# EasyEDA Pro project 4090_Portable_Fan.epro, schematic Schematic1_1
Board Name: 单节电池主板; Create Date: 2025-02-24; Page Name: P1; Project Name: 基于STC8G的风扇控制主板; Schematic Name: Schematic1; Update Date: 2025-12-03; BladeWidth: 10; Company: 嘉立创EDA; Page Size: A4; RegionStart: 1; ShowBorder: 1; TitleBlock: 1; TitleBlockPosition: 3; Version: V1.0; XRegionCount: 6; YRegionCount: 4
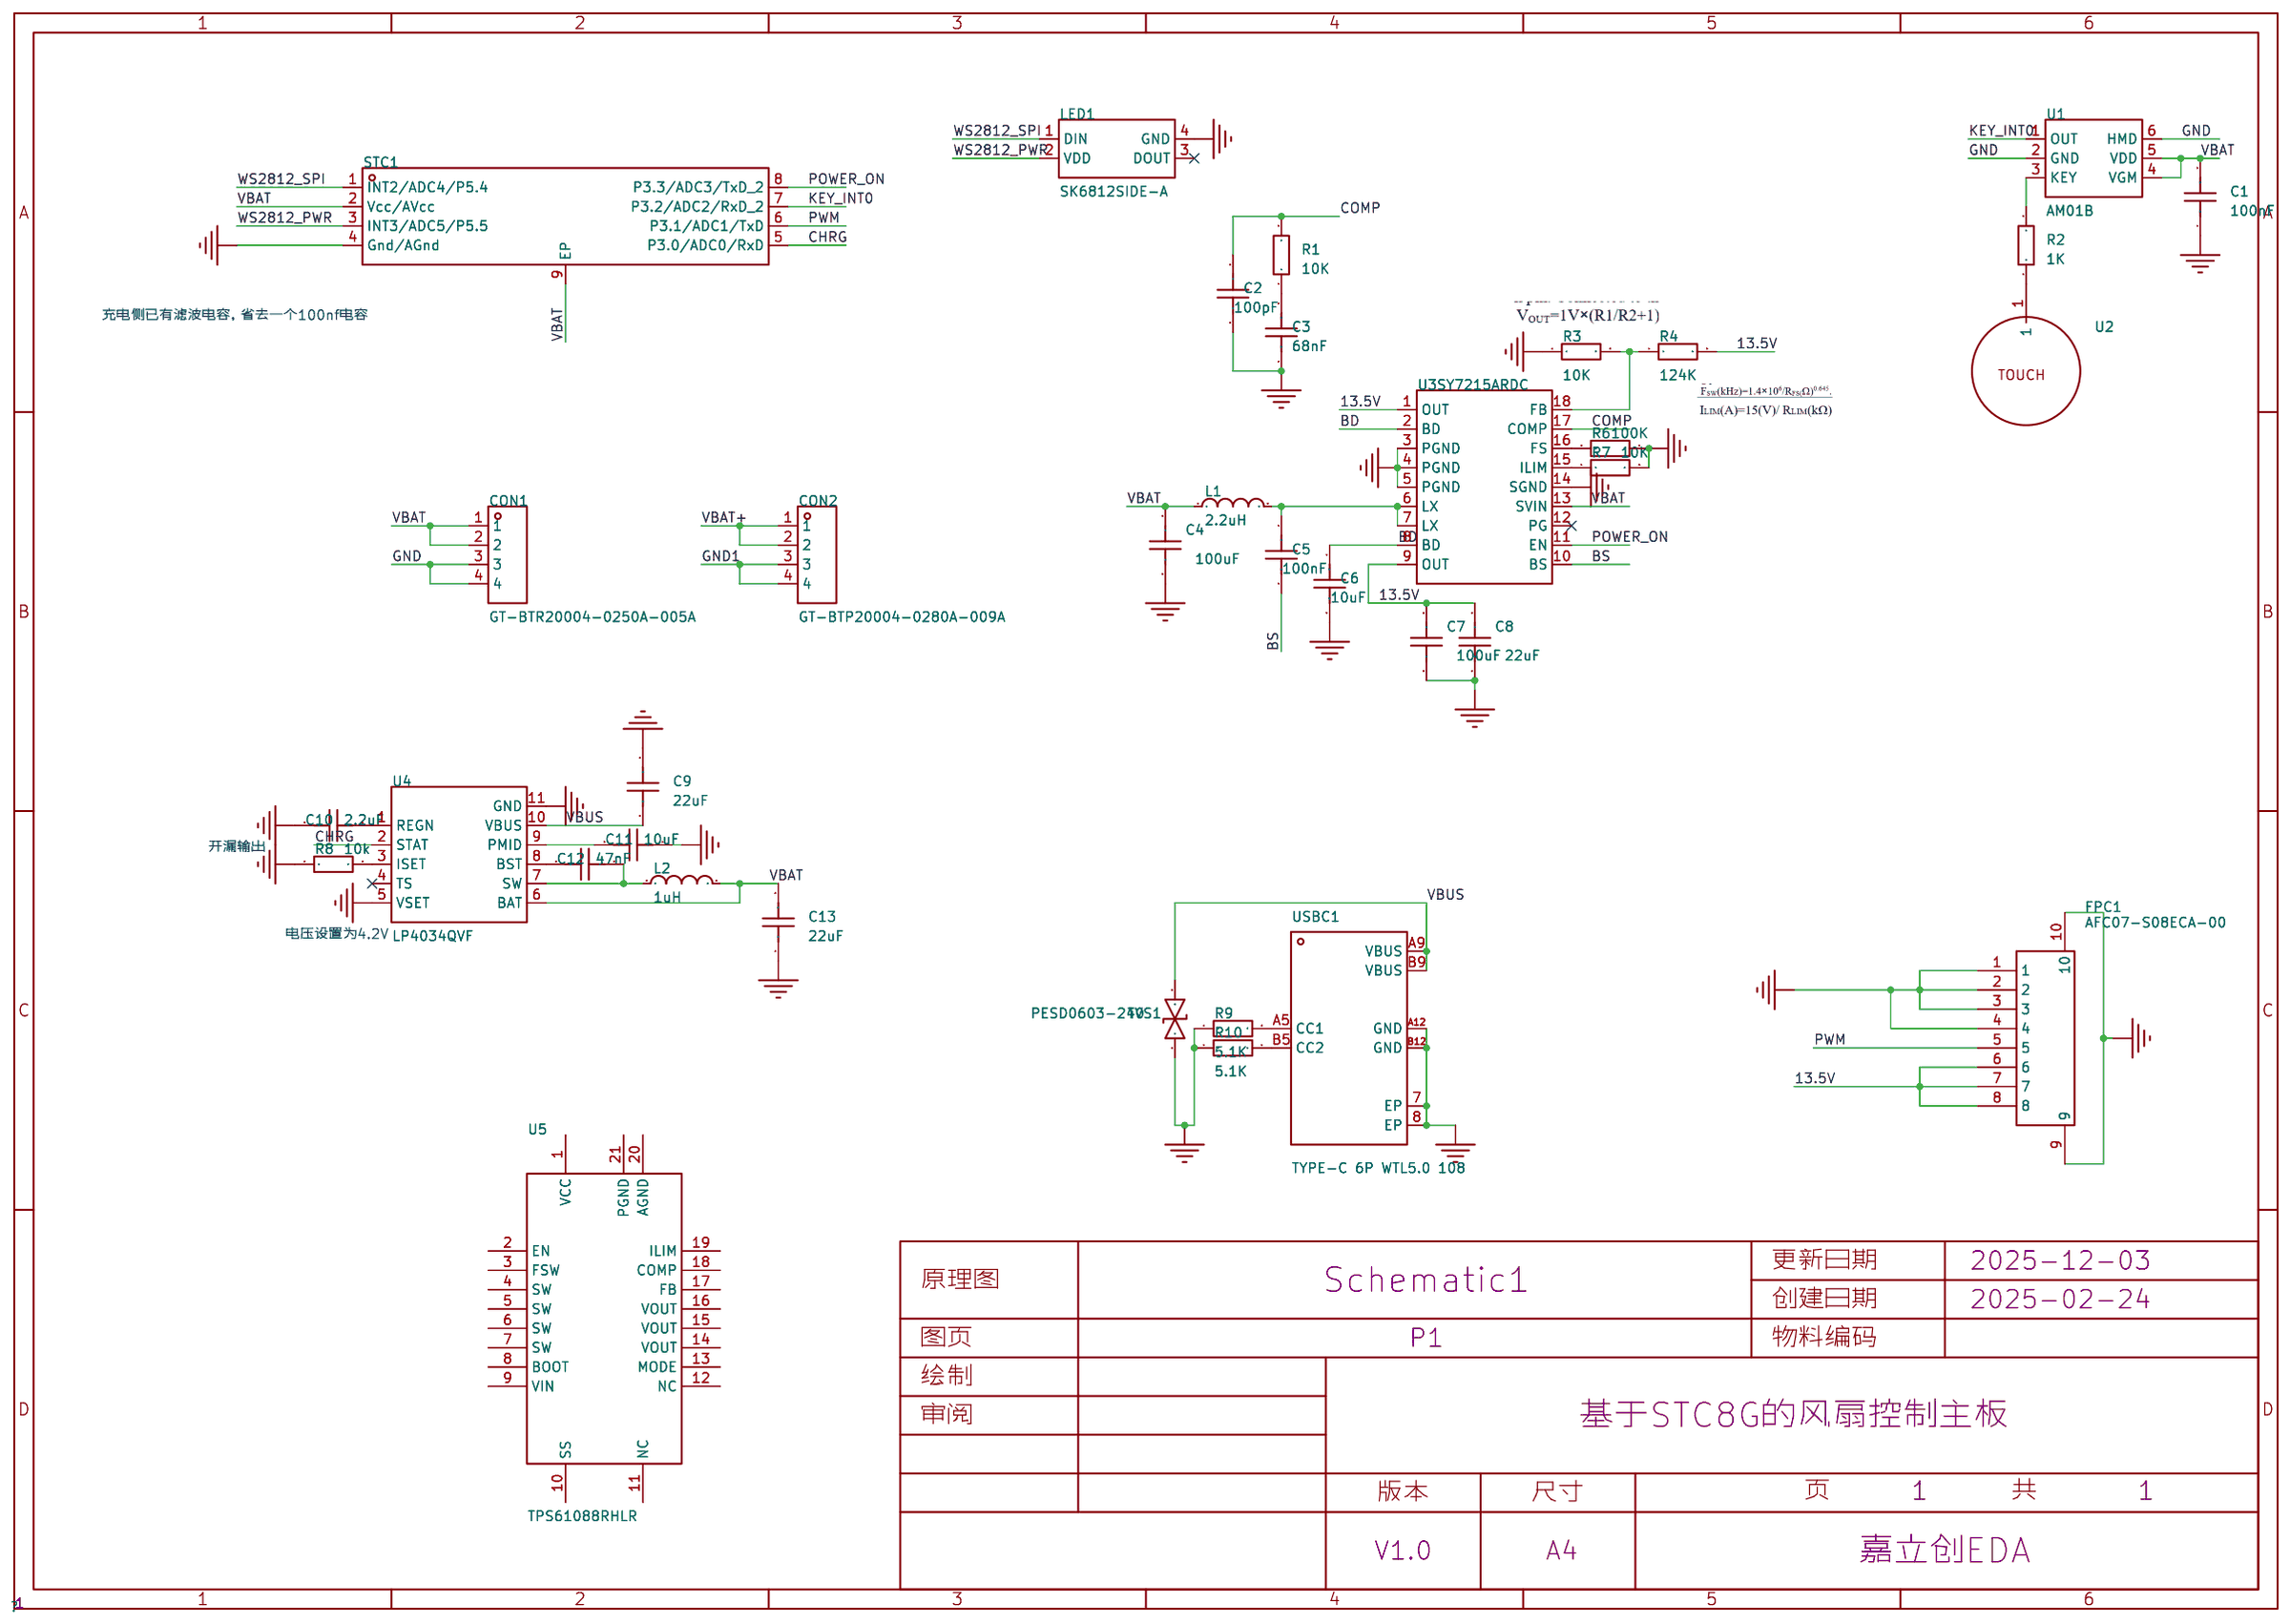
[diagram p2: schematic sheet]

## Parts
C1  100nF  [0805_S]
C2  100pF  [0805_S]
C3  68nF  [0805_S]
C4  100uF  [C1210]
C5  100nF  [0805_S]
C6  10uF  [0805_S]
C7  100uF  [C1210]
C8  22uF  [0805_S]
C9  22uF  [0805_S]
C10  2.2uF  [0805_S]
C11  10uF  [0805_S]
C12  47nF  [0805_S]
C13  22uF  [0805_S]
CON1  GT-BTR20004-0250A-005A  [CONN-SMD_GT-BTR20004-0250A-005A]
CON2  GT-BTP20004-0280A-009A  [CONN-TH_GT-BTP20004-0280A-009A]
FPC1  AFC07-S08ECA-00  [FPC-SMD_P0.5-8P_LCS-SH-H2.0]
L1  2.2uH  [IND-SMD_L7.0-W6.6_MCW-0650-220]
L2  1uH  [IND-SMD_L5.4-W5.2_FXL0530]
LED1  SK6812SIDE-A  [LED-SMD_4P-L4.0-W1.6-L]
R1  10K  [0805_S]
R2  1K  [0805_S]
R3  10K  [0805_S]
R4  124K  [0805_S]
R6  100K  [0805_S]
R7  10K  [0805_S]
R8  10k  [0805_S]
R9  5.1K  [0805_S]
R10  5.1K  [0805_S]
STC1  STC8G1K08A-36I-DFN8  [DFN-8_L3.0-W3.0-P0.50-BL-EP]
TVS1  PESD0603-240  [D0603-BI]
U1  AM01B  [SOT-23-6_L2.9-W1.6-P0.95-LS2.8-BL]
U2  -  [F9-10-6-0.4喇叭口无针触摸弹簧]
U3  SY7215ARDC  [QFN-18_L4.0-W4.0_SY7215ARDC]
U4  LP4034QVF  [DFN-10_L3.0-W3.0-P0.50-BL-EP2.5]
U5  TPS61088RHLR  [VQFN-20_L4.6-W3.6-P0.50-BL]
USBC1  TYPE-C 6P WTL5.0 108  [USB-C-SMD_TYPE-C-6P-WTL5.0-108]

## Library data of the parts
C1-C3 C5 C6 = CAP_604: Supplier Footprint: 0603
C4 C7 = HGC1210R5107M160NSVK: 容值:100uF;精度:±20%;额定电压:16V;温度系数:X5R;; LCSC Part Name: 100uF ±20% 16V; Supplier Part: C7432790; Manufacturer: Chinocera(华瓷); Supplier Footprint: 1210; JLCPCB Part Class: Extended Part; Datasheet: https://item.szlcsc.com/datasheet/HGC1210R5107M160NSVK/8438272.html; Supplier: LCSC; Tolerance: ±20%; Voltage Rating: 16V; Temperature Coefficient: X5R
C8-C13 = CAP_0603: Supplier Footprint: 0603
CON1 = GT-BTR20004-0250A-005A: 刀片电池母座/插接2.0间距/4PIN/塑高2.5/SMT有柱/4A; LCSC Part Name: 卧式Pitch2.0 4P电池母座; Supplier Part: C29780049; Manufacturer: G-Switch(品赞); Supplier Footprint: 插件,P=2mm; JLCPCB Part Class: 扩展库; Datasheet: https://atta.szlcsc.com/upload/public/pdf/source/20240802/6397B66360824D8B1E2E84EB4C77B31A.pdf; Supplier: LCSC; Connect Type: 刀片接触型(母); Pitch: 2mm; Number of Pins: 4P; Mounting Style: 立贴; Current Rating (Max): 4A; Voltage Rating (Max): 20V; Operating Temperature Range: -40℃~+85℃
CON2 = GT-BTP20004-0280A-009A: 刀片电池公座/插接2.0间距/4PIN/塑高2.8/SMT有柱/4A; LCSC Part Name: 立式Pitch2.0 4P电池公座; Supplier Part: C29780051; Manufacturer: G-Switch(品赞); Supplier Footprint: 插件,P=2mm; JLCPCB Part Class: 扩展库; Datasheet: https://atta.szlcsc.com/upload/public/pdf/source/20240802/BAA7DE6A9C3103806FD8D697C86A5FC4.pdf; Supplier: LCSC; Connect Type: 刀片接触型(公); Pitch: 2mm; Number of Pins: 4P; Mounting Style: 立贴; Current Rating (Max): 4A; Voltage Rating (Max): 20V; Contact Material: 磷青铜; Contact Plating: 金; Operating Temperature Range: -40℃~+85℃
FPC1 = AFC07-S08ECA-00: 锁定特性:抽屉式;触点类型:上接;触点数量:8P;间距:0.5mm;安装类型:卧贴;; LCSC Part Name: 间距:0.5mm P数:8P 抽屉式 上接; Supplier Part: C262581; Manufacturer: JS(钜硕电子); Supplier Footprint: SMD,P=0.5mm,卧贴; JLCPCB Part Class: Extended Part; Datasheet: https://atta.szlcsc.com/upload/public/pdf/source/20190726/C11082_A2E7B12387019CE4314BB5199EE0FDF4.pdf; Supplier: LCSC; Locking Feature: 抽屉式; Contact Type: 上接; Number of Contacts: 8P; Pitch: 0.5mm; Mounting Type: 卧贴; FFC, FCB Thickness: 0.3mm; Height Above Board: 2mm
L1 = FXL0650-2R2-M: 电感值:2.2uH;精度:±20%;额定电流:9A;饱和电流(Isat):11A;类型:一体成型电感;; LCSC Part Name: 2.2uH ±20% 11A; Supplier Part: C475528; Manufacturer: cjiang(长江微电); Supplier Footprint: SMD,6.6x7mm; JLCPCB Part Class: Extended Part; Datasheet: https://atta.szlcsc.com/upload/public/pdf/source/20240426/3189EA8206330E2108542F9E34E540E7.pdf; Supplier: LCSC; Tolerance: ±20%; Rated Current: 9A; Saturation Current (Isat): 11A; DC Resistance (DCR): 12.5mΩ; Type: 一体成型电感
L2 = FXL0530-1R0-M: 电感值:1uH;精度:±20%;额定电流:8.5A;饱和电流(Isat):11A;类型:一体成型电感;; LCSC Part Name: 1uH ±20% 11A; Supplier Part: C475517; Manufacturer: cjiang(长江微电); Supplier Footprint: SMD,5.2x5.4mm; JLCPCB Part Class: Extended Part; Datasheet: https://atta.szlcsc.com/upload/public/pdf/source/20240426/3189EA8206330E2108542F9E34E540E7.pdf; Supplier: LCSC; Tolerance: ±20%; Rated Current: 8.5A; Saturation Current (Isat): 11A; DC Resistance (DCR): 14mΩ; Type: 一体成型电感
LED1 = SK6812SIDE-A_C5378721: Supplier Part: C5378721; Manufacturer: 欧思科光电; Supplier Footprint: SMD-4P,4x1.6mm; JLCPCB Part Class: Extended Part; Datasheet: https://item.szlcsc.com/datasheet/SK6812SIDE-A/6242292.html; Supplier: LCSC
R1-R4 R6 R7 = Res_604: Supplier Footprint: 0603
R8-R10 = Res_0603: Supplier Footprint: 0603
STC1 = STC8G1K08A-36I-DFN8: CPU内核:51系列;应用领域:-;; Supplier Part: C915664; Manufacturer: STC; Supplier Footprint: DFN-8-EP(3x3); JLCPCB Part Class: 扩展库; Datasheet: https://atta.szlcsc.com/upload/public/pdf/source/20241226/1556D7EB67C0BC8C1661C3E278549CA4.pdf; Supplier: LCSC; CPU Core: 51系列; Program Storage Size: 8KB; Program Memory Type: FLASH
TVS1 = PESD0603-240_C2929617: 钳位电压:45V;击穿电压:-;; Supplier Part: C2929617; Manufacturer: Littelfuse(美国力特); Supplier Footprint: 0603; JLCPCB Part Class: 扩展库; Datasheet: https://atta.szlcsc.com/upload/public/pdf/source/20180516/C207186_7CE2F9DCABF8CE4AA3105E54FFDB24F6.pdf; Supplier: LCSC; Clamping Voltage: 45V; Number of Channels: 单路; Type: ESD
U1 = AM01B: 通道数:1;芯片功能:电容式触摸;是否自锁:是;; Supplier Part: C485387; Manufacturer: XMXW(芯网); Supplier Footprint: SOT-23-6L; JLCPCB Part Class: Extended Part; Datasheet: https://item.szlcsc.com/datasheet/AM01B/493832.html; Supplier: LCSC; Number of Channels: 1; Chip Function: 电容式触摸; Whether the Lock: 是; Voltage - Supply: 2.3V~5.5V; Current - Supply: 5uA; Operating Temperature: -20℃~+85℃
U2 = F9-10-6-0.4喇叭口无针触摸弹簧
U3 = SY7215ARDC: 功能类型:升压型;工作电压:3V~16V;输出类型:可调;; LCSC Part Name: 升压型 3V~16V; Supplier Part: C207633; Manufacturer: Silergy(矽力杰); Supplier Footprint: QFN-18(4x4); JLCPCB Part Class: Extended Part; Datasheet: https://item.szlcsc.com/datasheet/SY7215ARDC/208849.html; Supplier: LCSC; Function: 升压型; Voltage - Supply: 3V~16V; Frequency - Switching: 250kHz~1MHz；345kHz; Synchronous Rectifier: 是; Number of Outputs: 1; Topology: 升压式; Switch tube (built-in/external): 内置; Output Type: 可调
U4 = LP4034QVF: 工作电压:4.1V~6.2V;最大充电电流:3.5A;电池类型:锂电池;电池节数:1;; LCSC Part Name: 高效3.5A无传感器开关充电器; Supplier Part: C42460070; Manufacturer: LOWPOWER(微源半导体); Supplier Footprint: DFN-10-EP(3x3); JLCPCB Part Class: Extended Part; Datasheet: https://item.szlcsc.com/datasheet/LP4034QVF/44542704.html; Supplier: LCSC; The Chip Type: 充电芯片; Voltage - Supply: 4.1V~6.2V; Charge Current - Max: 3.5A; Type of Battery: 锂电池; Number of Cells: 1; Operating Temperature: -40℃~+125℃; Battery Temperature Detection: 支持; Supply Current (Iq): 5uA
U5 = TPS61088RHLR: 功能类型:升压型;输出类型:可调;工作电压:2.7V~12V;输出电压:4.5V~12.6V;输出电流:10A;; LCSC Part Name: 全集成同步升压转换器; Supplier Part: C87357; Manufacturer: TI(德州仪器); Supplier Footprint: VQFN-20-EP(3.6x4.6); JLCPCB Part Class: Extended Part; Datasheet: https://www.ti.com/cn/lit/gpn/tps61088; Supplier: LCSC; Function: 升压型; Output Type: 可调; Input Voltage: 2.7V~12V; Output Voltage: 4.5V~12.6V; Output Current: 10A; Switching Frequency: 200kHz~2.2MHz; Operating Temperature: -40℃~+85℃; Synchronous Rectification: 是; Number of Outputs: 1; Topology: 升压式; Switch tube (built-in/external): 内置
USBC1 = TYPE-C 6P WTL5.0 108: 连接器类型:Type-C;公母:母;安装方式:卧贴;触点数量:6P;端口数量:1;额定电流 - 电源:3A;工作温度范围:-20℃~+85℃;; LCSC Part Name: Type-C 母 卧贴; Supplier Part: C30167323; Manufacturer: SHOU HAN(首韩); Supplier Footprint: SMD; JLCPCB Part Class: 扩展库; Datasheet: https://atta.szlcsc.com/upload/public/pdf/source/20240719/5FA0E35FE16D69FE6470A929035FA38A.pdf; Supplier: LCSC; Connector Type: Type-C; Gender: 母; Mounting Style: 卧贴; Number of Contacts: 6P; Number of Ports: 1; Current Rating - Power (Max): 3A; Rated Voltage (Max): 5V; Connect-Disconnect Life: 5千次; Length: 5mm; Core Colour: 黑色; Operating Temperature Range: -20℃~+85℃

## Nets
13.5V: C7.2 C8.1 FPC1.6 FPC1.7 FPC1.8 R4.2 U3.1(OUT) U3.9(OUT)
GND: C1.1 C2.2 C3.2 C4.1 C6.2 C7.1 C8.2 C9.1 C10.2 C11.1 C13.1 CON1.3 CON1.4 FPC1.1 FPC1.2 FPC1.3 FPC1.4 FPC1.9 FPC1.10 LED1.4(GND) R3.1 R6.1 R7.2 R8.1 R9.1 R10.1 STC1.4(Gnd/AGnd) TVS1.1 U1.2(GND) U1.6(HMD) U3.3(PGND) U3.4(PGND) U3.5(PGND) U3.14(SGND) U4.5(VSET) U4.11(GND) USBC1.7(EP) USBC1.8(EP) USBC1.A12(GND) USBC1.B12(GND)
GND1: CON2.3 CON2.4
VBAT: C1.2 C4.2 C13.2 CON1.1 CON1.2 L1.1 L2.2 STC1.2(Vcc/AVcc) STC1.9(EP) U1.4(VGM) U1.5(VDD) U3.13(SVIN) U4.6(BAT)
VBAT+: CON2.1 CON2.2
VBUS: C9.2 TVS1.2 U4.10(VBUS) USBC1.A9(VBUS) USBC1.B9(VBUS)
BD: C6.1 U3.2(BD) U3.8(BD)
BS: C5.2 U3.10(BS)
CHRG: STC1.5(P3.0/ADC0/RxD) U4.2(STAT)
COMP: C2.1 R1.2 U3.17(COMP)
KEY_INT0: STC1.7(P3.2/ADC2/RxD_2) U1.1(OUT)
POWER_ON: STC1.8(P3.3/ADC3/TxD_2) U3.11(EN)
PWM: FPC1.5 STC1.6(P3.1/ADC1/TxD)
WS2812_PWR: LED1.2(VDD) STC1.3(INT3/ADC5/P5.5)
WS2812_SPI: LED1.1(DIN) STC1.1(INT2/ADC4/P5.4)
$1N19622: R9.2 USBC1.A5(CC1)
$1N19624: R10.2 USBC1.B5(CC2)
$1N43171: C5.1 L1.2 U3.6(LX) U3.7(LX)
$1N43181: R6.2 U3.16(FS)
$1N43183: R3.2 R4.1 U3.18(FB)
$1N43190: R7.1 U3.15(ILIM)
$1N43193: C3.1 R1.1
$1N43198: R2.2 U1.3(KEY)
$1N43200: R2.1 U2.1
$1N43207: C12.1 L2.1 U4.7(SW)
$1N43212: C12.2 U4.8(BST)
$1N43213: C11.2 U4.9(PMID)
$1N43216: R8.2 U4.3(ISET)
$1N43221: C10.1 U4.1(REGN)

Not connected (* = marked no-connect by the designer): LED1 3(DOUT)*; U3 12(PG)*; U4 4(TS)*; U5 1(VCC) 2(EN) 3(FSW) 4(SW) 5(SW) 6(SW) 7(SW) 8(BOOT) 9(VIN) 10(SS) 11(NC) 12(NC) 13(MODE) 14(VOUT) 15(VOUT) 16(VOUT) 17(FB) 18(COMP) 19(ILIM) 20(AGND) 21(PGND)

## Notes on the sheet
- 充电侧已有滤波电容，省去一个100nf电容
- 开漏输出
- 电压设置为4.2V
